# Altium schematic sheet 0.96OLED_SSD1306.SchDoc
size A4
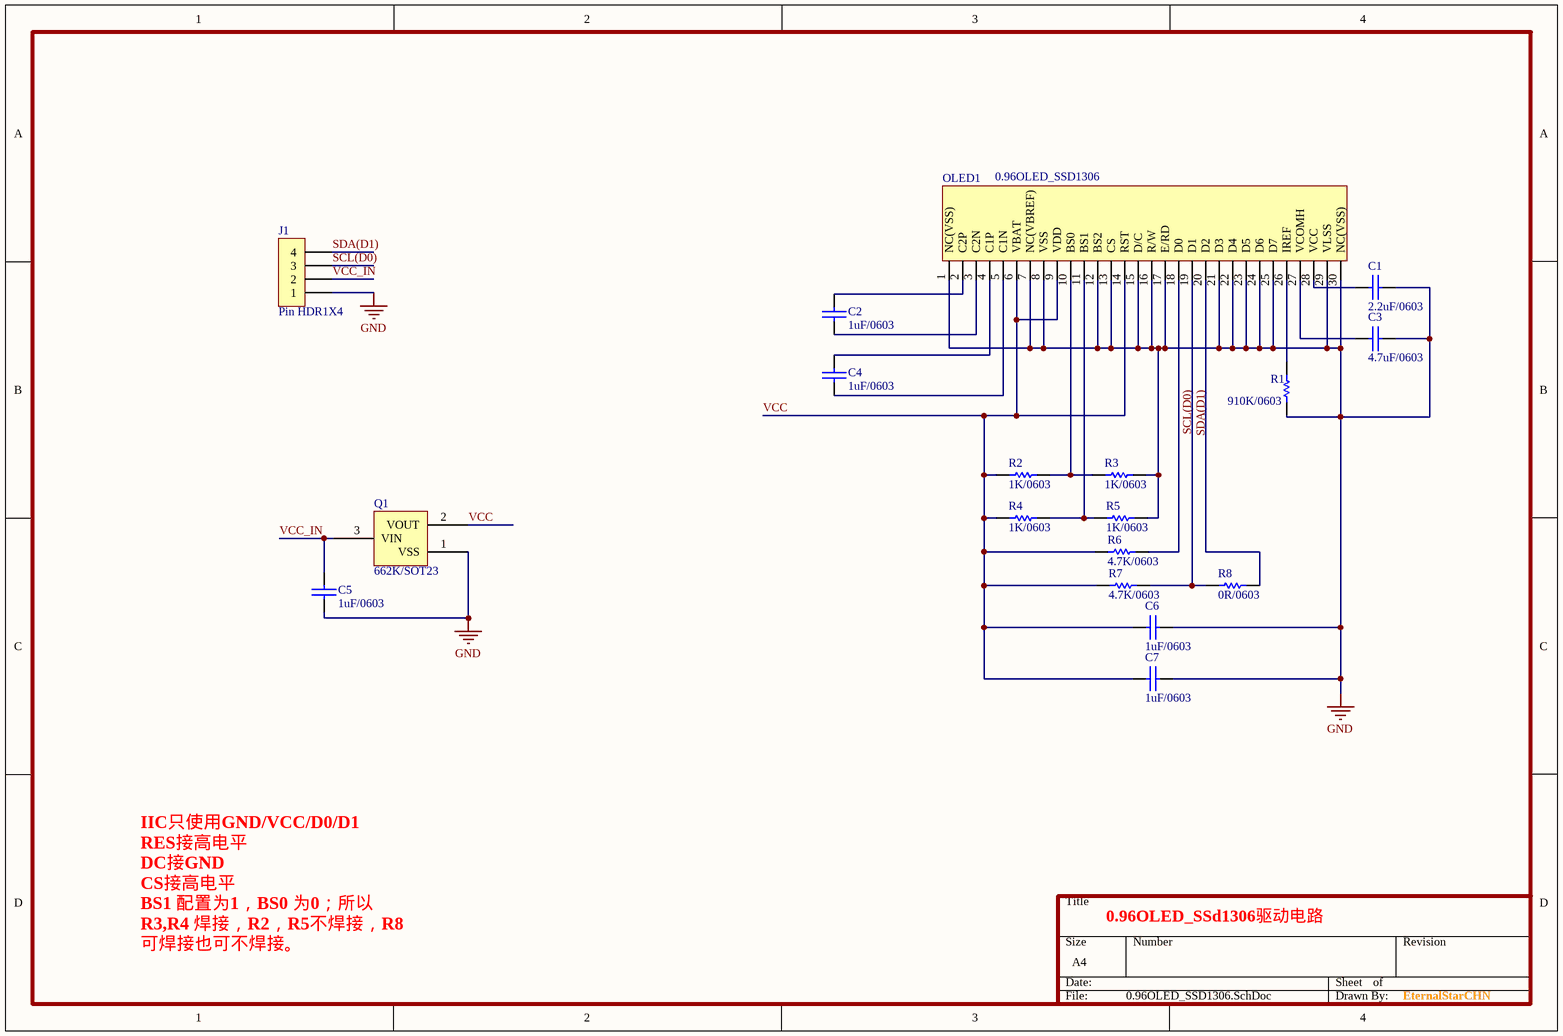
[diagram p0: 0.96OLED_SSD1306.SchDoc]

## Parts
C1  2.2uF/0603  [0603C]
C2  1uF/0603  [0603C]
C3  4.7uF/0603  [0603C]
C4  1uF/0603  [0603C]
C5  1uF/0603  [0603C]
C6  1uF/0603  [0603C]
C7  1uF/0603  [0603C]
J1  Pin HDR1X4  [Pin HDR1X4/2.54mm-S]
OLED1  0.96OLED_SSD1306  [OLED_0.96]
Q1  662K/SOT23  [SOT23]
R1  910K/0603  [0603R]
R2  1K/0603  [0603R]
R3  1K/0603  [0603R]
R4  1K/0603  [0603R]
R5  1K/0603  [0603R]
R6  4.7K/0603  [0603R]
R7  4.7K/0603  [0603R]
R8  0R/0603  [0603R]

## Nets
GND: C1.1 C3.1 C5.2 C6.1 C7.1 J1.1 OLED1.1(NC(VSS)) OLED1.7(NC(VBREF)) OLED1.8(VSS) OLED1.12(BS2) OLED1.13(CS) OLED1.15(D/C) OLED1.16(R/W) OLED1.17(E/RD) OLED1.21(D3) OLED1.22(D4) OLED1.23(D5) OLED1.24(D6) OLED1.25(D7) OLED1.29(VLSS) OLED1.30(NC(VSS)) Q1.1(VSS) R1.1 R3.1 R5.1
SCL(D0): J1.3 OLED1.18(D0) R6.1
SDA(D1): J1.4 OLED1.19(D1) R7.1 R8.2
VCC: C6.2 C7.2 OLED1.6(VBAT) OLED1.9(VDD) OLED1.14(RST) Q1.2(VOUT) R2.2 R4.2 R6.2 R7.2
VCC_IN: C5.1 J1.2 Q1.3(VIN)
NetC1_2: C1.2 OLED1.28(VCC)
NetC2_1: C2.1 OLED1.3(C2N)
NetC2_2: C2.2 OLED1.2(C2P)
NetC3_2: C3.2 OLED1.27(VCOMH)
NetC4_1: C4.1 OLED1.5(C1N)
NetC4_2: C4.2 OLED1.4(C1P)
NetOLED1_10: OLED1.10(BS0) R2.1 R3.2
NetOLED1_11: OLED1.11(BS1) R4.1 R5.2
NetOLED1_20: OLED1.20(D2) R8.1
NetOLED1_26: OLED1.26(IREF) R1.2

## Notes on the sheet
- 0.96OLED_SSd1306驱动电路
- IIC只使用GND/VCC/D0/D1
  RES接高电平
  DC接GND
  CS接高电平
  BS1 配置为1，BS0 为0；所以R3,R4 焊接，R2，R5不焊接，R8 可焊接也可不焊接。
- EternalStarCHN

## Library data of the parts
C1-C7 = CAP: 无极性电容
Q1 = LDO_SOT23: SOT23封装LDO
R1-R8 = RES